# EAGLE design 6thNov_submission_12V_everywhere (EAGLE 8.3.2)
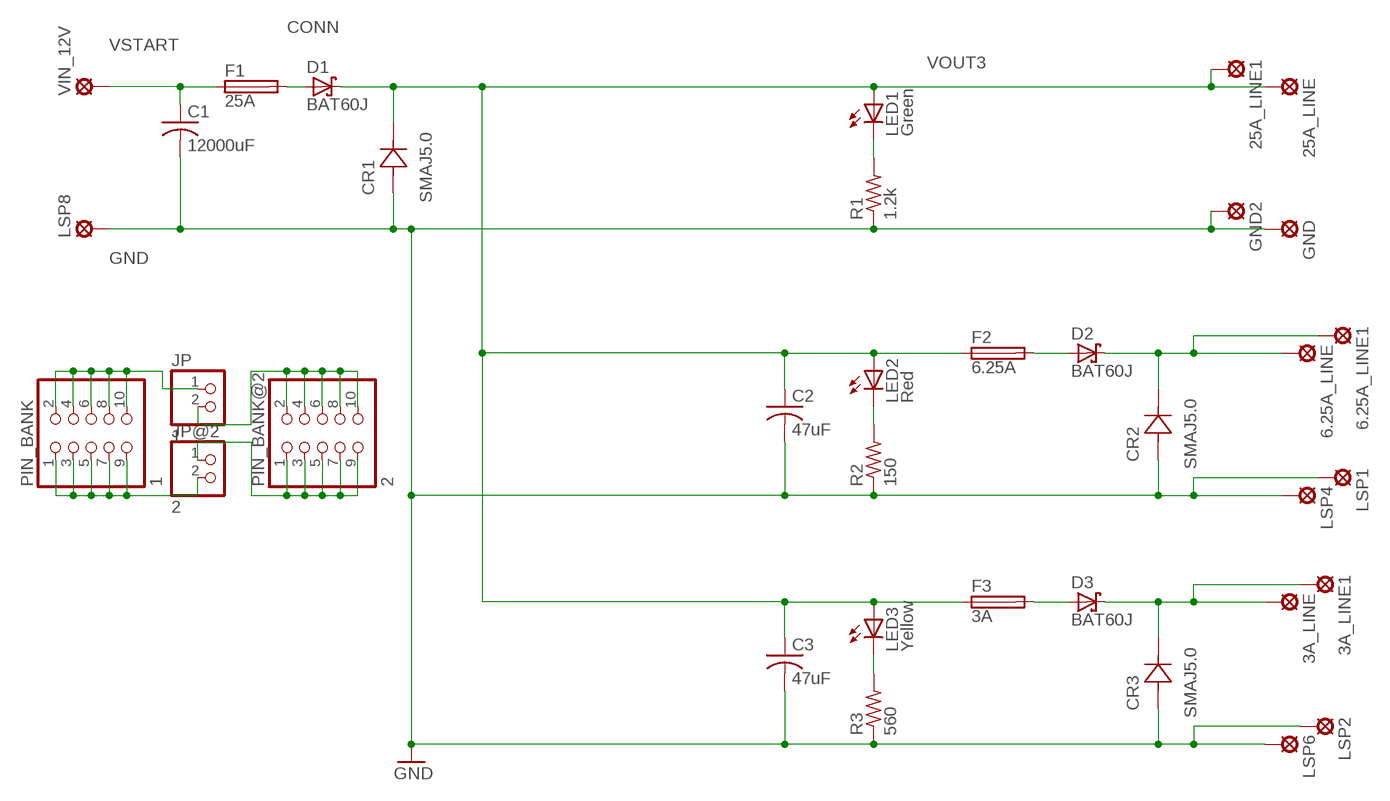
[diagram p0: schematic, sheet 1]

## Parts
3A_LINE  SE13  [SE13]
3A_LINE1  SE13  [SE13]
6.25A_LINE  SE13  [SE13]
6.25A_LINE1  SE13  [SE13]
25A_LINE  SE13  [SE13]
25A_LINE1  SE13  [SE13]
C1  12000uF  C-USC1206K  [C1206K]
C2  47uF  C-USC1206K  [C1206K]
C3  47uF  C-USC1206K  [C1206K]
CR1  SMAJ5.0  [SMASERIES]
CR2  SMAJ5.0  [SMASERIES]
CR3  SMAJ5.0  [SMASERIES]
D1  BAT60J  [SOD323_ST]
D2  BAT60J  [SOD323_ST]
D3  BAT60J  [SOD323_ST]
F1  25A  TE5  [TE5]
F2  6.25A  TE5  [TE5]
F3  3A  TE5  [TE5]
GND  SE13  [SE13]
GND2  SE13  [SE13]
JP  1  PINHD-1X2  [1X02]
JP@2  2  PINHD-1X2  [1X02]
LED1  Green  LEDCHIPLED_1206  [CHIPLED_1206]
LED2  Red  LEDCHIPLED_1206  [CHIPLED_1206]
LED3  Yellow  LEDCHIPLED_1206  [CHIPLED_1206]
LSP1  SE13  [SE13]
LSP2  SE13  [SE13]
LSP4  SE13  [SE13]
LSP6  SE13  [SE13]
LSP8  SE13  [SE13]
PIN_BANK  1  PINHD-2X5  [2X05]
PIN_BANK@2  2  PINHD-2X5  [2X05]
R1  1.2k  R-US_R1206  [R1206]
R2  150  R-US_R1206  [R1206]
R3  560  R-US_R1206  [R1206]
VIN_12V  SE13  [SE13]

## Nets
CONN: D1.A F1.2
GND: C1.2 C2.2 C3.2 CR1.2 CR2.2 CR3.2 GND2.MP GND.MP LSP1.MP LSP2.MP LSP4.MP LSP6.MP LSP8.MP R1.1 R2.1 R3.1
N$1: JP@2.1 PIN_BANK@2.1 PIN_BANK@2.3 PIN_BANK@2.5 PIN_BANK@2.7 PIN_BANK@2.9
N$2: JP@2.2 PIN_BANK.1 PIN_BANK.3 PIN_BANK.5 PIN_BANK.7 PIN_BANK.9
N$6: LED1.C R1.2
N$8: JP.1 PIN_BANK.2 PIN_BANK.4 PIN_BANK.6 PIN_BANK.8 PIN_BANK.10
N$9: JP.2 PIN_BANK@2.2 PIN_BANK@2.4 PIN_BANK@2.6 PIN_BANK@2.8 PIN_BANK@2.10
N$12: D2.A F2.2
N$13: 6.25A_LINE1.MP 6.25A_LINE.MP CR2.1 D2.C
N$15: LED2.C R2.2
N$17: D3.A F3.2
N$18: 3A_LINE1.MP 3A_LINE.MP CR3.1 D3.C
N$20: LED3.C R3.2
VOUT3: 25A_LINE1.MP 25A_LINE.MP C2.1 C3.1 CR1.1 D1.C F2.1 F3.1 LED1.A LED2.A LED3.A
VSTART: C1.1 F1.1 VIN_12V.MP

## Library data of the parts
3A_LINE 3A_LINE1 6.25A_LINE 6.25A_LINE1 25A_LINE 25A_LINE1 GND GND2 LSP1 LSP2 LSP4 LSP6 LSP8 VIN_12V = solpad:SE13: SOLDER PAD E1542, drill 1,3mm, distributor Buerklin, 07F815
C1-C3 = rcl:C-US: CAPACITOR, American symbol
CR1-CR3 = SMAJ5_diode:SMAJ5.0; MANUFACTURER_PART_NUMBER: SMAJ5.0; VENDOR: Littelfuse Inc
D1-D3 = diode:BAT60J: Schottky barrier diode Source: www.st.com, BAT60J.pdf
F1-F3 = fuse:TE5: FUSE Wickmann; OC_FARNELL: unknown; OC_NEWARK: unknown
JP JP@2 = pinhead:PINHD-1X2: PIN HEADER
LED1-LED3 = led:LED: LED OSRAM: - CHIPLED LG R971, LG N971, LY N971, LG Q971, LY Q971, LO R971, LY R971 LH N974, LH R974 LS Q976, LO Q976, LY Q976 LO Q996 - Hyper CHIPLED LW Q18S LB Q993, LB Q99A, LB R99A - SideLED LS A670, LO A670, LY A670, LG A670, LP A670 LB A673, LV A673, LT A673, LW A673 LH A674 LY A675 LS A676, LA A676, LO A676, LY A676, LW A676 LS A679, LY A679, LG A679 - Hyper Micro SIDELED® LS Y876, LA Y876, LO Y876, LY Y876 LT Y87S - SmartLED LW L88C, LW L88S LB L89C, LB L89S, LG L890 LS L89K, LO L89K, LY L89K LS L896, LA L896, LO L896, LY L896 - TOPLED LS T670, LO T670, LY T670, LG T670, LP T670 LSG T670, LSP T670, LSY T670, LOP T670, LYG T670 LG T671, LOG T671, LSG T671 LB T673, LV T673, LT T673, LW T673 LH T674 LS T676, LA T676, LO T676, LY T676, LB T676, LH T676, LSB T676, LW T676 LB T67C, LV T67C, LT T67C, LS T67K, LO T67K, LY T67K, LW E67C LS E67B, LA E67B, LO E67B, LY E67B, LB E67C, LV E67C, LT E67C LW T67C LS T679, LY T679, LG T679 LS T770, LO T770, LY T770, LG T770, LP T770 LB T773, LV T773, LT T773, LW T773 LH T774 LS E675, LA E675, LY E675, LS T675 LS T776, LA T776, LO T776, LY T776, LB T776 LHGB T686 LT T68C, LB T68C - Hyper Mini TOPLED® LB M676 - Mini TOPLED Santana® LG M470 LS M47K, LO M47K, LY M47K Source: http://www.osram.convergy.de LUXEON: - LUMILED® LXK2-PW12-R00, LXK2-PW12-S00, LXK2-PW14-U00, LXK2-PW14-V00 LXK2-PM12-R00, LXK2-PM12-S00, LXK2-PM14-U00 LXK2-PE12-Q00, LXK2-PE12-R00, LXK2-PE12-S00, LXK2-PE14-T00, LXK2-PE14-U00 LXK2-PB12-K00, LXK2-PB12-L00, LXK2-PB12-M00, LXK2-PB14-N00, LXK2-PB14-P00, LXK2-PB14-Q00 LXK2-PR12-L00, LXK2-PR12-M00, LXK2-PR14-Q00, LXK2-PR14-R00 LXK2-PD12-Q00, LXK2-PD12-R00, LXK2-PD12-S00 LXK2-PH12-R00, LXK2-PH12-S00 LXK2-PL12-P00, LXK2-PL12-Q00, LXK2-PL12-R00 Source: www.luxeon.com KINGBRIGHT: KA-3528ASYC Source: www.kingbright.com
PIN_BANK PIN_BANK@2 = pinhead:PINHD-2X5: PIN HEADER
R1-R3 = rcl:R-US_: RESISTOR, American symbol

## Board
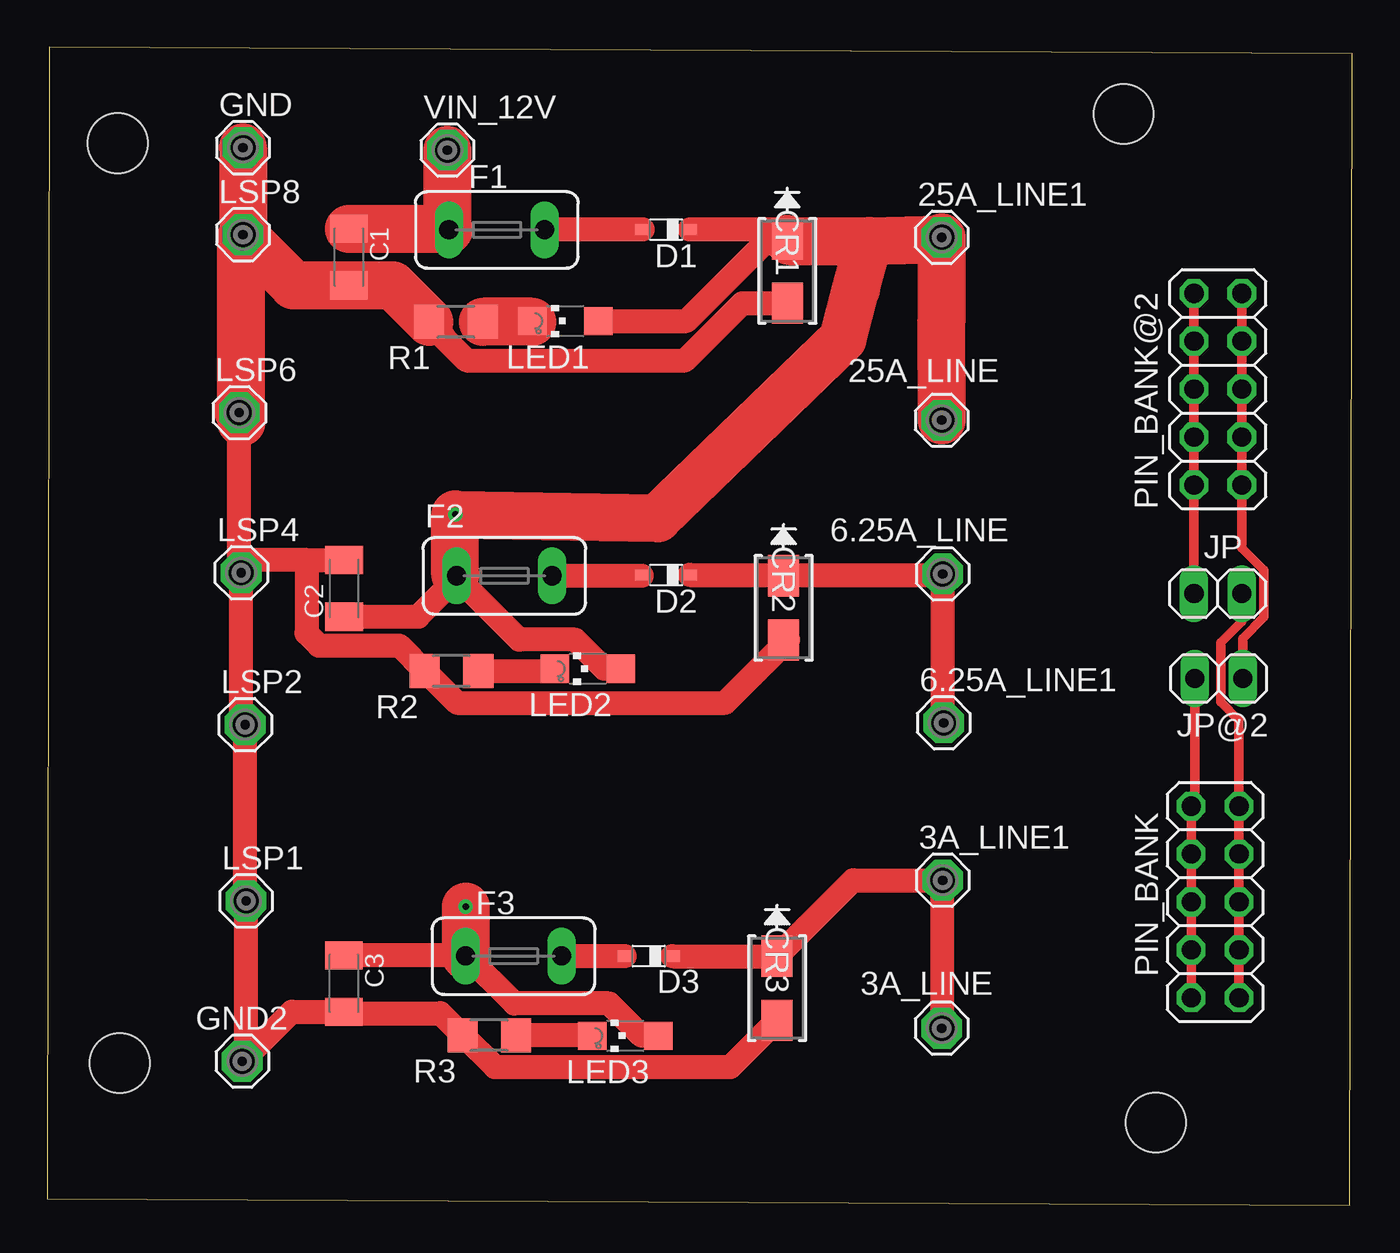
[diagram p1: board, top side]
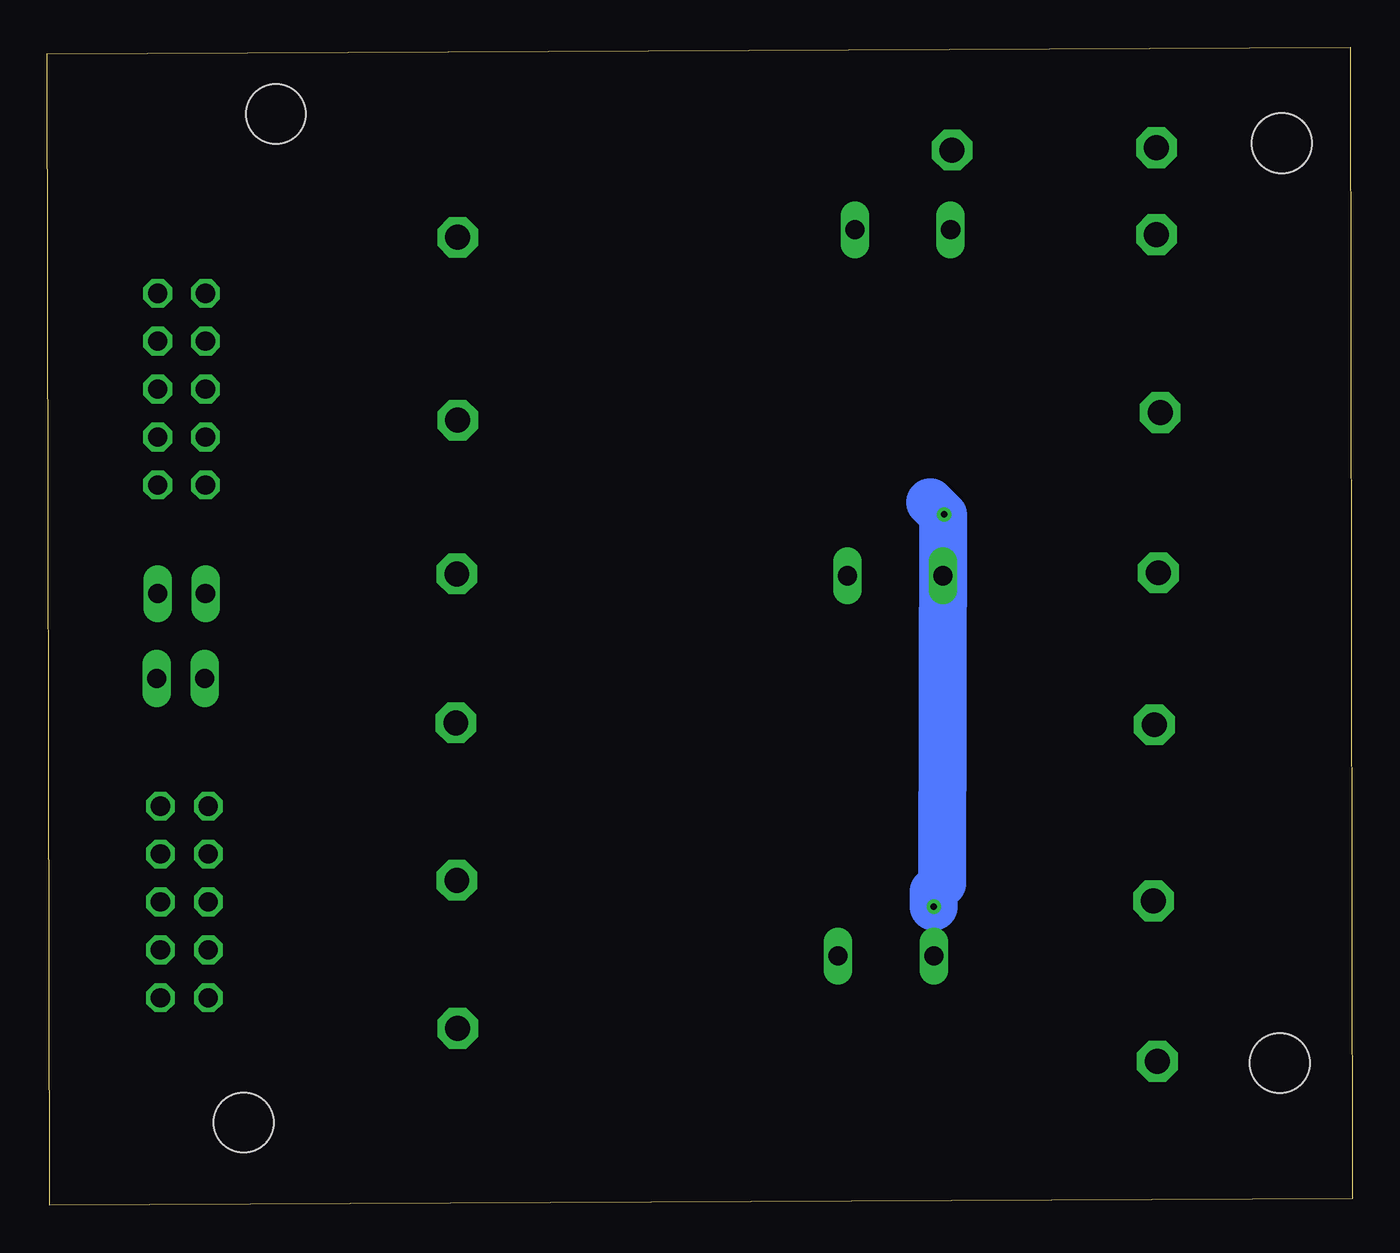
[diagram p2: board, bottom side, seen from below]

Size 69.23 x 61.44 mm. Coordinates in mm from the lower left corner, seen from the top.
Outline: 0,0.35 69.08,0 69.23,61.09 0.1,61.44 0,0.35
Copper layers (1*16): Top 0.035mm / dielectric 1.5mm / Bottom 0.035mm
Design rules "default": minimum track width 6mil, minimum drill 0.35mm, track to track 6mil, track to pad 6mil, pad to pad 6mil, via to via 6mil, smd to smd 6mil, copper to edge 40mil, drill to drill 6mil, minimum pad ring 10mil, minimum via ring 8mil, stop-mask expansion 4mil, vias tented up to drill 0mil, thermal gap 10mil
Holes 3.17 mm at 3.75,56.35 3.85,7.55 58.8,4.4 57.1,57.9

### Footprints (pad centres in the part's own frame; a part is rotated, then mirrored left to right if it is on the bottom)
SE13 = drill 1.321 pad 2.159 octagon: MP 0,0
C1206K = smd 1.5 x 2: 1 -1.5,0; 2 1.5,0
SMASERIES = smd 2.184 x 1.651: 1 -1.702,0; 2 1.702,0
SOD323_ST = smd 0.8 x 0.6: A 1.25,0; C -1.25,0
TE5 = drill 1.016 long: 1 -2.54,0; 2 2.54,0
1X02 = drill 1.016 long: 1 -1.27,0; 2 1.27,0
CHIPLED_1206 = smd 1.5 x 1.5: A 0,-1.75; C 0,1.75
2X05 = drill 1.016 octagon: 1 -5.08,-1.27; 2 -5.08,1.27; 3 -2.54,-1.27; 4 -2.54,1.27; 5 0,-1.27; 6 0,1.27; 7 2.54,-1.27; 8 2.54,1.27; 9 5.08,-1.27; 10 5.08,1.27
R1206 = smd 1.6 x 1.803: 1 -1.422,0; 2 1.422,0

### Placement (x,y rotation side)
3A_LINE  47.45,9.4 0 top
3A_LINE1  47.5,17.25 0 top
6.25A_LINE  47.5,33.5 0 top
6.25A_LINE1  47.55,25.6 0 top
25A_LINE  47.45,41.65 0 top
25A_LINE1  47.45,51.35 0 top
C1  16,50.31 270 top
C2  15.75,32.73 90 top
C3  15.74,11.77 270 top
CR1  39.26,49.56 270 top
CR2  39.06,31.7 270 top
CR3  38.72,11.52 270 top
D1  32.83,51.76 180 top
D2  32.83,33.44 180 top
D3  31.91,13.22 180 top
F1  23.85,51.75 0 top
F2  24.25,33.4 0 top
F3  24.74,13.23 0 top
GND  10.39,56.11 0 top
GND2  10.35,7.65 0 top
JP  62.1,32.45 180 top
JP@2  62.15,27.95 180 top
LED1  27.49,46.91 90 top
LED2  28.68,28.47 90 top
LED3  30.67,9 90 top
LSP1  10.55,16.15 0 top
LSP2  10.5,25.5 0 top
LSP4  10.29,33.56 0 top
LSP6  10.19,42.05 0 top
LSP8  10.39,51.49 0 top
PIN_BANK  61.95,16.1 270 top
PIN_BANK@2  62.1,43.3 90 top
R1  21.69,46.87 0 top
R2  21.45,28.35 0 top
R3  23.45,9.03 0 top
VIN_12V  21.23,55.98 0 top

### Tracks (layer width: path | path; a pad name or v marks a point on that pad's centre or on a via)
CONN
  Top 1.27: D1.A F1.2
GND
  Top 1.27: CR3.2 36.24,7.34 23.75,7.34 22.06,9.03 R3.1 20.86,10.2 15.81,10.2 C3.2 12.97,10.27 GND2.MP 10.55,7.85 LSP1.MP 10.5,16.2 LSP2.MP 10.29,25.71 LSP4.MP | CR1.2 36.87,47.86 33.83,44.81 22.26,44.81 21.05,46.02 21.05,46.08 R1.1 | CR2.2 39.3,30 35.96,26.66 21.75,26.66 20.06,28.35 R2.1 18.69,29.69 14.42,29.69 13.76,30.36 13.8,30.4 13.8,34.23 | LSP4.MP 10.15,33.7 10.15,42.2 | LSP4.MP 10.96,34.23 13.8,34.23 | 13.8,34.23 C2.2
  Top 2.54: R1.1 18.33,48.81 C1.2 13.07,48.81 LSP8.MP | GND.MP LSP8.MP | LSP8.MP 10.3,51.4 10.3,41.55 10.3,41.94 LSP6.MP 10.15,42.09 10.15,42.2
N$1
  Top 0.508: PIN_BANK@2.9 PIN_BANK@2.7 PIN_BANK@2.5 PIN_BANK@2.3 PIN_BANK@2.1 63.37,34.86 64.54,33.7 64.54,31.2 63.42,30.09 JP@2.1
N$2
  Top 0.508: JP@2.2 60.88,21.38 PIN_BANK.1 PIN_BANK.3 PIN_BANK.5 60.68,13.85 | 60.68,13.85 PIN_BANK.7 | PIN_BANK.9 60.68,13.85
N$6
  Top 0.152: 25.73,46.87 25.8,46.8
  Top 1.27: LED1.C 25.73,46.87
  Top 2.54: 25.73,46.87 R1.2
N$8
  Top 0.508: JP.1 63.37,30.97 62.25,29.85 62.25,26.7 63.22,25.74 PIN_BANK.2 PIN_BANK.4 PIN_BANK.6 PIN_BANK.8 PIN_BANK.10
N$9
  Top 0.508: PIN_BANK@2.10 PIN_BANK@2.8 PIN_BANK@2.6 PIN_BANK@2.4 PIN_BANK@2.2 JP.2
N$12
  Top 0.152: 31.54,33.4 D2.A
  Top 1.27: F2.2 31.54,33.4
N$13
  Top 0.152: CR2.1 39.02,33.44
  Top 1.27: D2.C 39.02,33.44 | 6.25A_LINE1.MP 47.5,25.65 6.25A_LINE.MP 47.4,33.4 CR2.1
N$15
  Top 1.27: R2.2 26.81,28.35 LED2.C
N$17
  Top 0.152: D3.A
  Top 1.27: F3.2 D3.A
N$18
  Top 0.152: CR3.1
  Top 1.27: D3.C CR3.1 | CR3.1 42.75,17.25 3A_LINE1.MP 47.45,17.2 3A_LINE.MP
N$20
  Top 1.27: 28.95,9.03 R3.2 | 29.05,8.95 28.97,9.03 28.95,9.03 | LED3.C 28.95,9.03
VOUT3  (via drill 0.35)
  Top 0.152: 22.23,13.27 22.35,13.15 | 21.65,33.46 F2.1
  Top 1.27: 22.23,13.27 C3.1 | C2.1 19.68,31.23 21.75,33.3 | 38.76,51.76 D1.C | 38.76,51.76 CR1.1 | LED1.A 33.91,46.91 38.76,51.76 | LED2.A 29.54,28.47 28.01,30.01 25.04,30.01 21.75,33.3 | 22.23,13.27 24.78,10.72 29.82,10.72 31.53,9 LED3.A | F2.1 21.75,33.36 21.75,33.3 | F3.1 22.23,13.26 22.23,13.27
  Top 2.54: v22.2,15.85 F3.1 | 21.65,33.46 v21.65,36.65 32.38,36.45 42.21,45.98 42.91,48.62 43.6,51.16 | CR1.1 39.36,51.16 43.6,51.16 | 25A_LINE.MP 47.44,46.99 47.44,51.26 | 43.6,51.16 47.44,51.26 | 25A_LINE1.MP 47.44,51.34 47.44,51.26
  Bottom 0.152: 21.7,36.6 v21.65,36.65
  Bottom 2.54: v22.2,15.85 22.2,16.65 21.75,17.1 21.7,36.6 22.4,37.3
VSTART
  Top 0.152: 21.25,51.81 F1.1 21.31,52.81
  Top 2.54: C1.1 21.25,51.81 | F1.1 21.23,51.83 VIN_12V.MP